# EasyEDA schematic SCH_Meshtastic-ESP32-C3-super-mini-+-DX-LR-30_2026-05-31.json
TITLE: ESP32-C3 Supermini to DX-LR-30; REV: 1.0; Date: 2026-05-17; Sheet: 1/1; Drawn By: rzeldent; Company: rzeldent
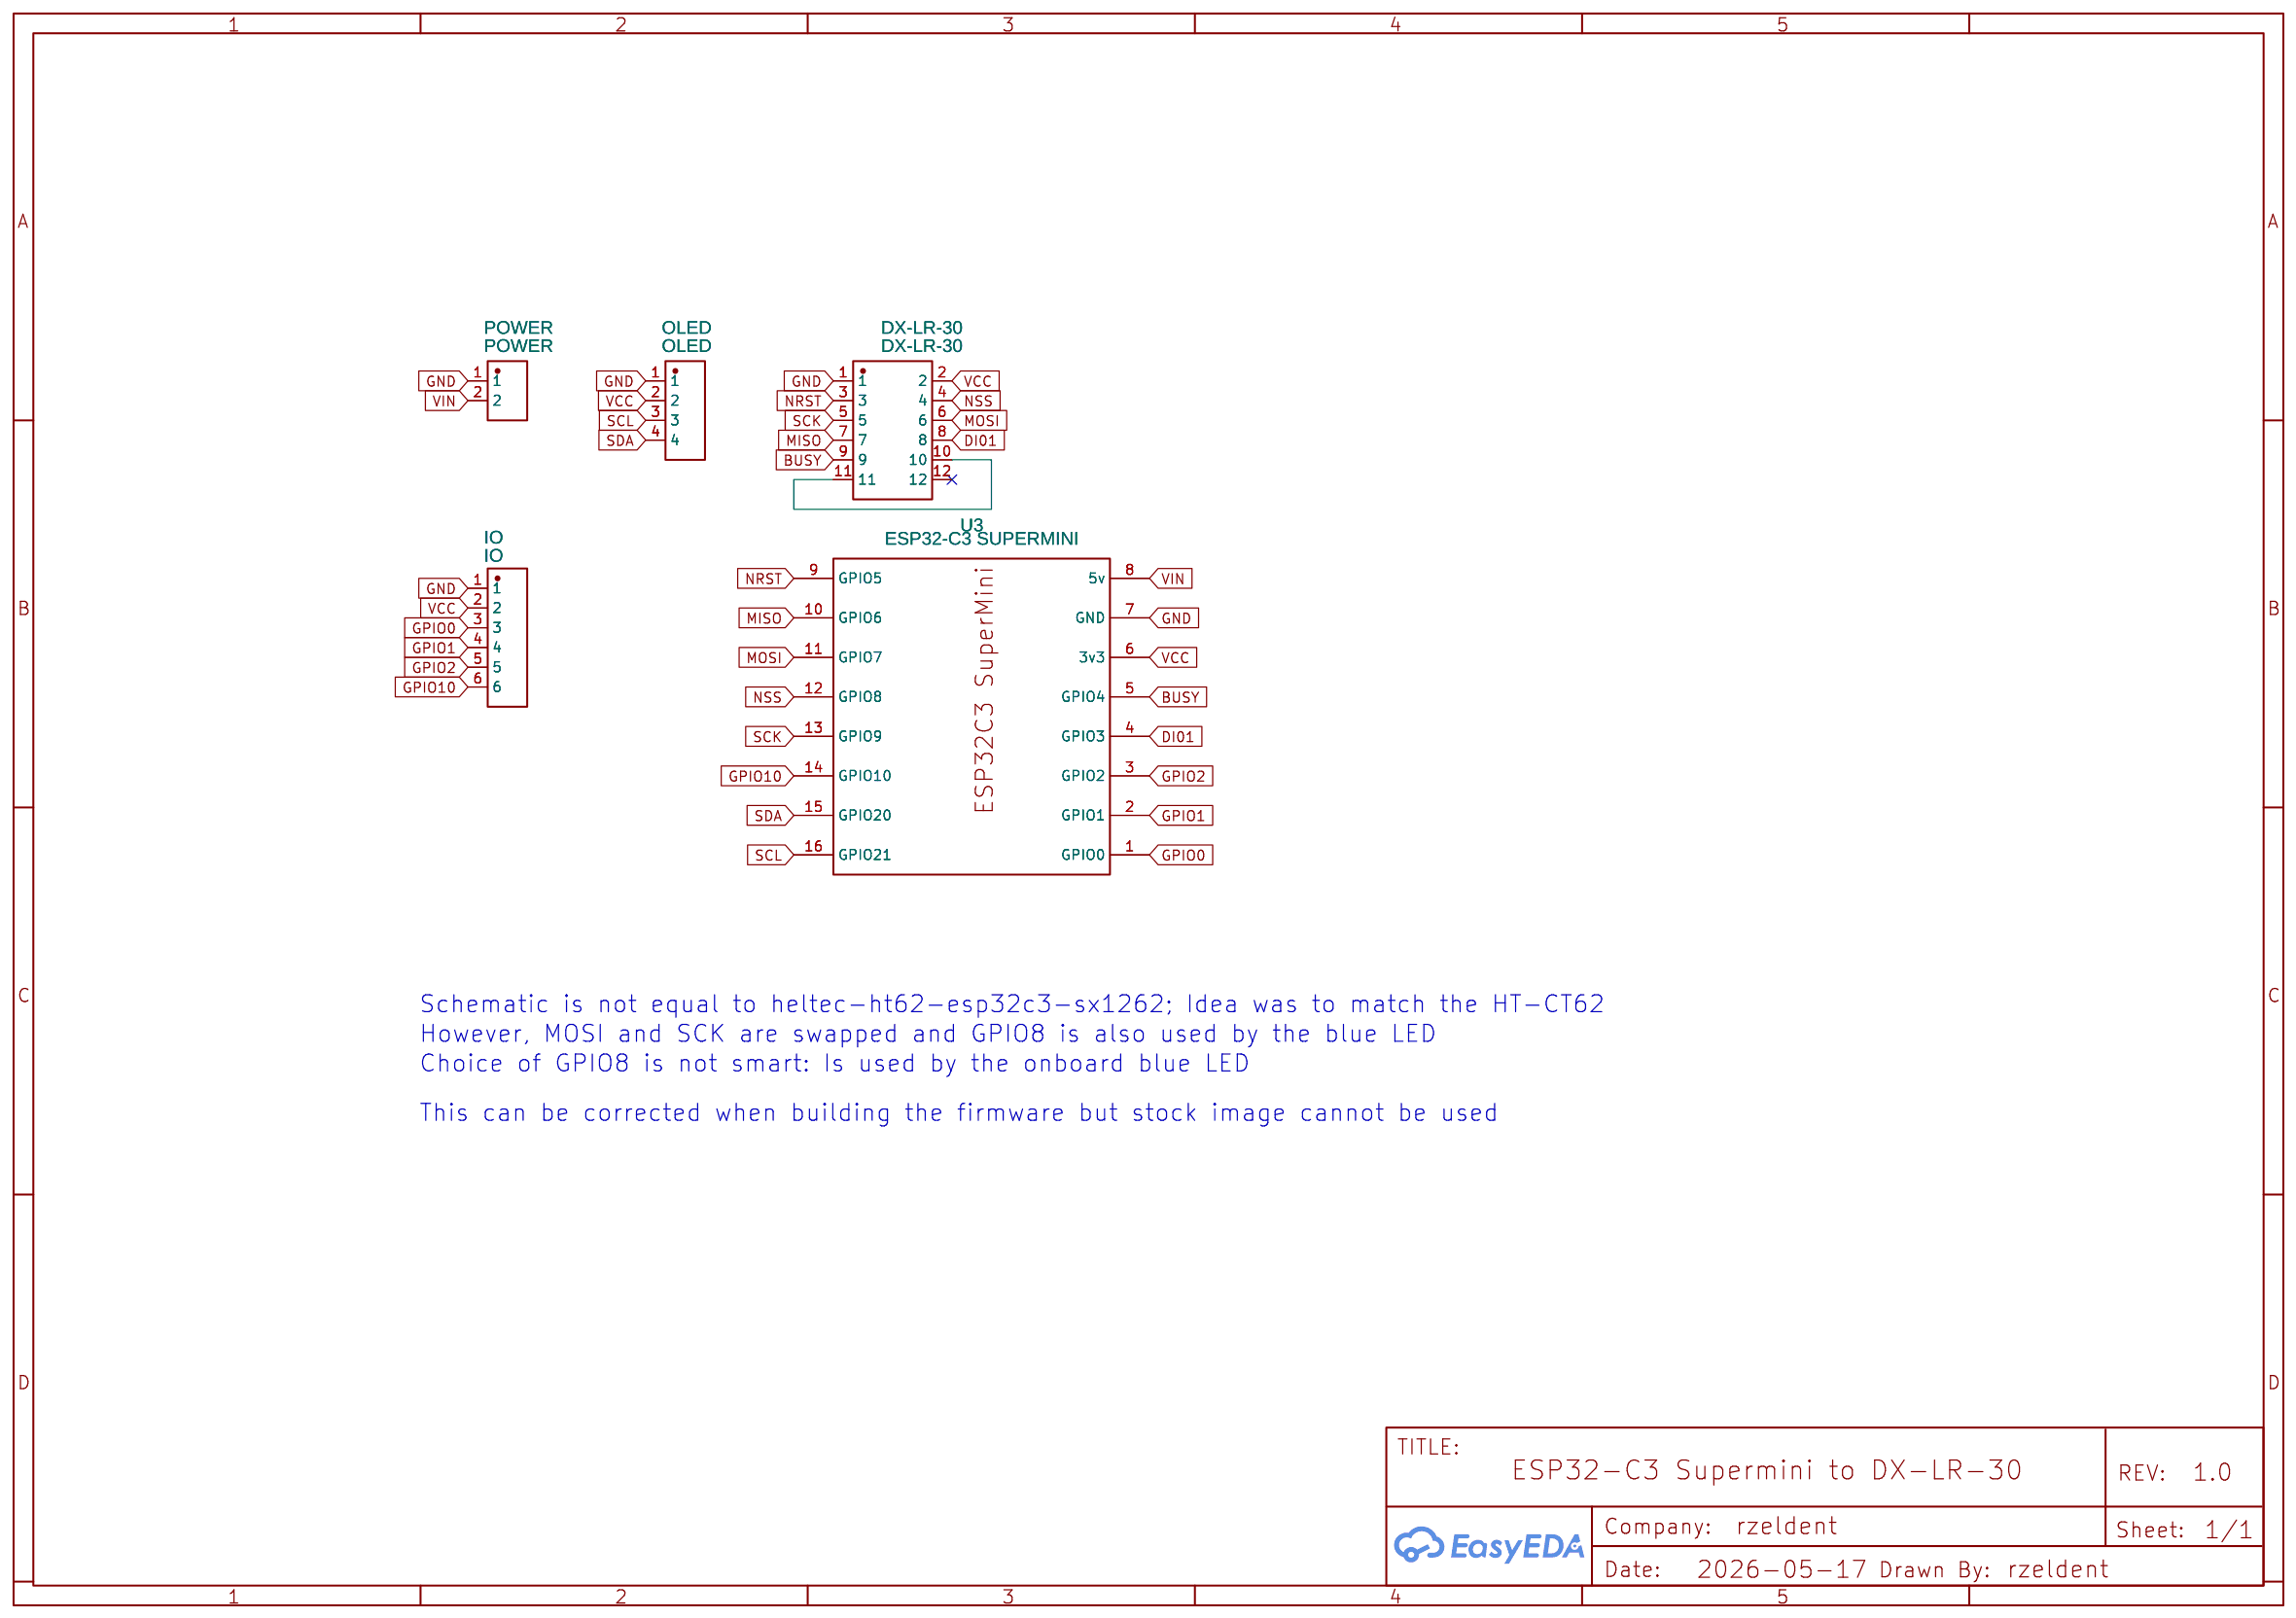
[diagram p0: schematic sheet]

## Parts
DX-LR-30  DX-LR-30  [HDR-TH_PM2.54-2X6PZZ-H8.5]
IO  IO  [HDR-TH_6P-P2.54-V-F-H3.5]
OLED  OLED  [HDR-TH_4P-P2.54-V-F]
POWER  POWER  [HDR-TH_2P-P2.54-V-F]
U3  ESP32-C3 SUPERMINI  [ESP32C3 SUPERMINI]

## Library data of the parts
DX-LR-30 = PM2.54-2X6PZZ-H8.5: Supplier: LCSC; Supplier Part: C54876742; Manufacturer: SHOU HAN(首韩); Manufacturer Part: PM2.54-2x6PZZ-H8.5; Contributor: lcsc; JLCPCB Part Class: Extended Part
IO = X6511FV-06-C85D32: Supplier: LCSC; Supplier Part: C718239; Manufacturer: XKB Connectivity; Contributor: igelectronica; JLCPCB Part Class: Extended Part; Package Display: No
OLED = PM2.54-1*4: Contributor: lcsc; Supplier: LCSC; Supplier Part: C5116530; Manufacturer: ZHOURI(洲日); JLCPCB Part Class: Extended Part
POWER = XDM254-1-02-Z-8.5-G0: Supplier: LCSC; Supplier Part: C19268695; Manufacturer: XUNDA(讯答); Contributor: diego.martos.tavares
U3 = ESP32C3 SUPERMINI: Contributor: nomdetom

## Nets
GND: DX-LR-30.1 IO.1 OLED.1 POWER.1 U3.7(GND)
VCC: DX-LR-30.2 IO.2 OLED.2 U3.6(3v3)
VIN: POWER.2 U3.8(5v)
BUSY: DX-LR-30.9 U3.5(GPIO4)
DI01: DX-LR-30.8 U3.4(GPIO3)
GPIO0: IO.3 U3.1(GPIO0)
GPIO1: IO.4 U3.2(GPIO1)
GPIO2: IO.5 U3.3(GPIO2)
GPIO10: IO.6 U3.14(GPIO10)
MISO: DX-LR-30.7 U3.10(GPIO6)
MOSI: DX-LR-30.6 U3.11(GPIO7)
NRST: DX-LR-30.3 U3.9(GPIO5)
NSS: DX-LR-30.4 U3.12(GPIO8)
SCK: DX-LR-30.5 U3.13(GPIO9)
SCL: OLED.3 U3.16(GPIO21)
SDA: OLED.4 U3.15(GPIO20)
Net-(DX-LR-30-10): DX-LR-30.10 DX-LR-30.11

Not connected (* = marked no-connect by the designer): DX-LR-30 12*

## Notes on the sheet
- Schematic is not equal to heltec-ht62-esp32c3-sx1262; Idea was to match the HT-CT62
- However, MOSI and SCK are swapped and GPIO8 is also used by the blue LED
- Choice of GPIO8 is not smart: Is used by the onboard blue LED
- This can be corrected when building the firmware but stock image cannot be used
